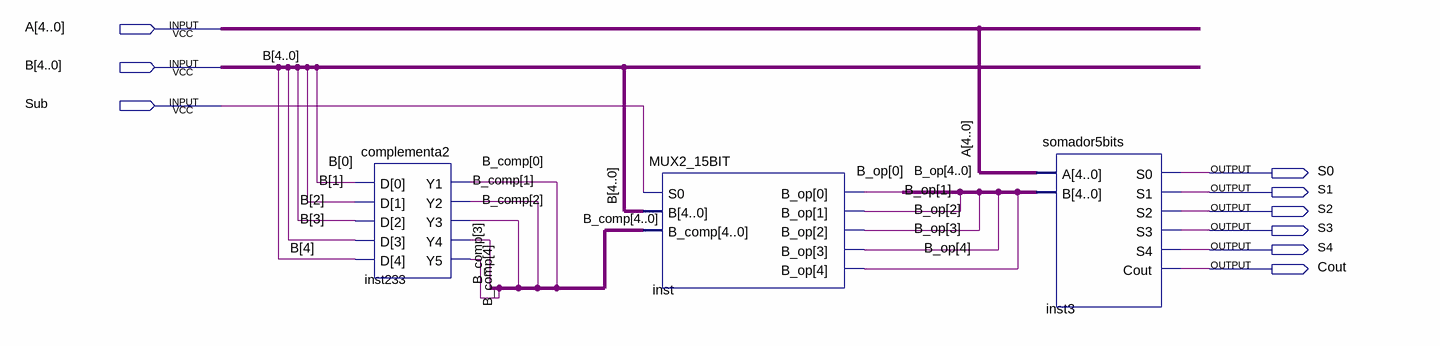
[diagram p0: schematic sheet]
// Quartus schematic CALCULADORA.bdf as structural Verilog: 3 symbols, 9 pins
module CALCULADORA (
  input  [4:0] A,
  input  [4:0] B,
  input  Sub,
  output S0,
  output S1,
  output S2,
  output S3,
  output S4,
  output Cout
);

  wire [4:0] B_comp, B_op;

  complementa2 inst233 (.D(B), .Y1(B_comp[0]), .Y2(B_comp[1]), .Y3(B_comp[2]), .Y4(B_comp[3]), .Y5(B_comp[4]));
  MUX2_15BIT inst (.S0(Sub), .B(B), .B_comp(B_comp), .B_op(B_op));
  somador5bits inst3 (.A(A), .B(B_op), .S0(S0), .S1(S1), .S2(S2), .S3(S3), .S4(S4), .Cout(Cout));
endmodule
